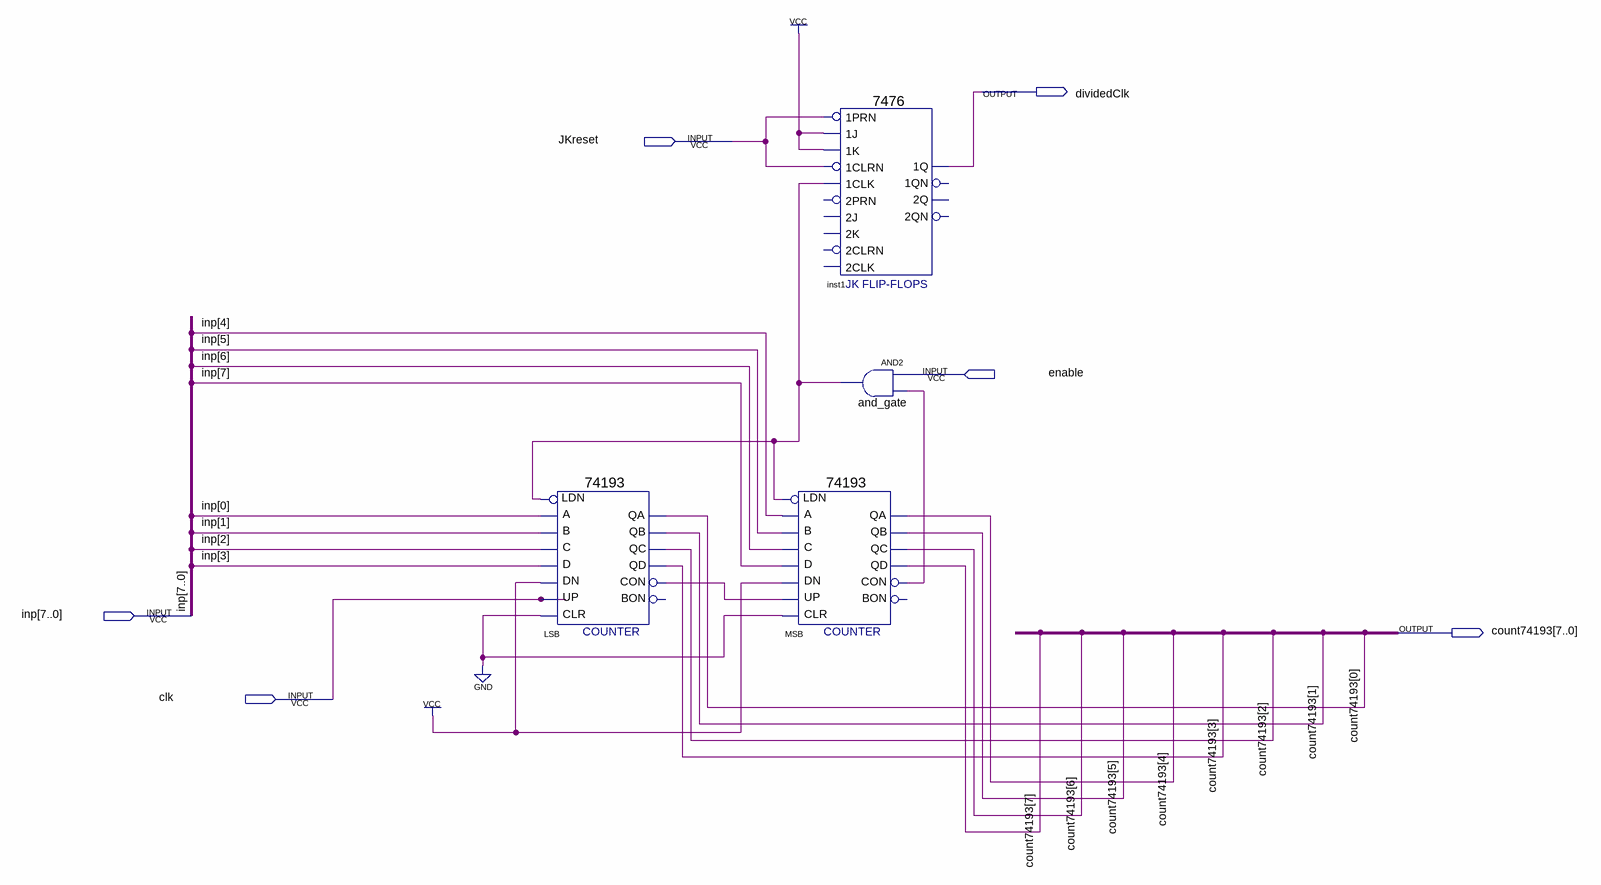
[diagram p0: schematic sheet]
// Quartus schematic ClockDivider.bdf as structural Verilog: 4 symbols, 6 pins
module ClockDivider (
  input  JKreset,
  input  enable,
  input  [7:0] inp,
  input  clk,
  output dividedClk,
  output [7:0] count74193
);

  wire and_gate_out, LSB_con, MSB_con;

  \74193  LSB (
    .D(inp[3]), .C(inp[2]), .B(inp[1]), .A(inp[0]), .CLR(1'b0), .UP(clk), .DN(1'b1), .LDN(and_gate_out),
    .QB(count74193[1]), .QA(count74193[0]), .CON(LSB_con), .QD(count74193[3]), .QC(count74193[2]));  // open: BON
  \74193  MSB (
    .D(inp[7]), .C(inp[6]), .B(inp[5]), .A(inp[4]), .CLR(1'b0), .UP(LSB_con), .DN(1'b1), .LDN(and_gate_out),
    .QB(count74193[5]), .QA(count74193[4]), .CON(MSB_con), .QD(count74193[7]), .QC(count74193[6]));  // open: BON
  \7476  inst1 (
    .\1J (1'b1), .\1K (1'b1), .\1PRN (JKreset), .\1CLK (and_gate_out), .\1CLRN (JKreset), .\1Q (dividedClk));  // open: 2PRN, 2J, 2K, 2CLRN, 2CLK, 2QN, 2Q, 1QN
  and and_gate (and_gate_out, enable, MSB_con);
endmodule
